# Altium schematic sheet PowerAmplifier_Front.SchDoc
size A4
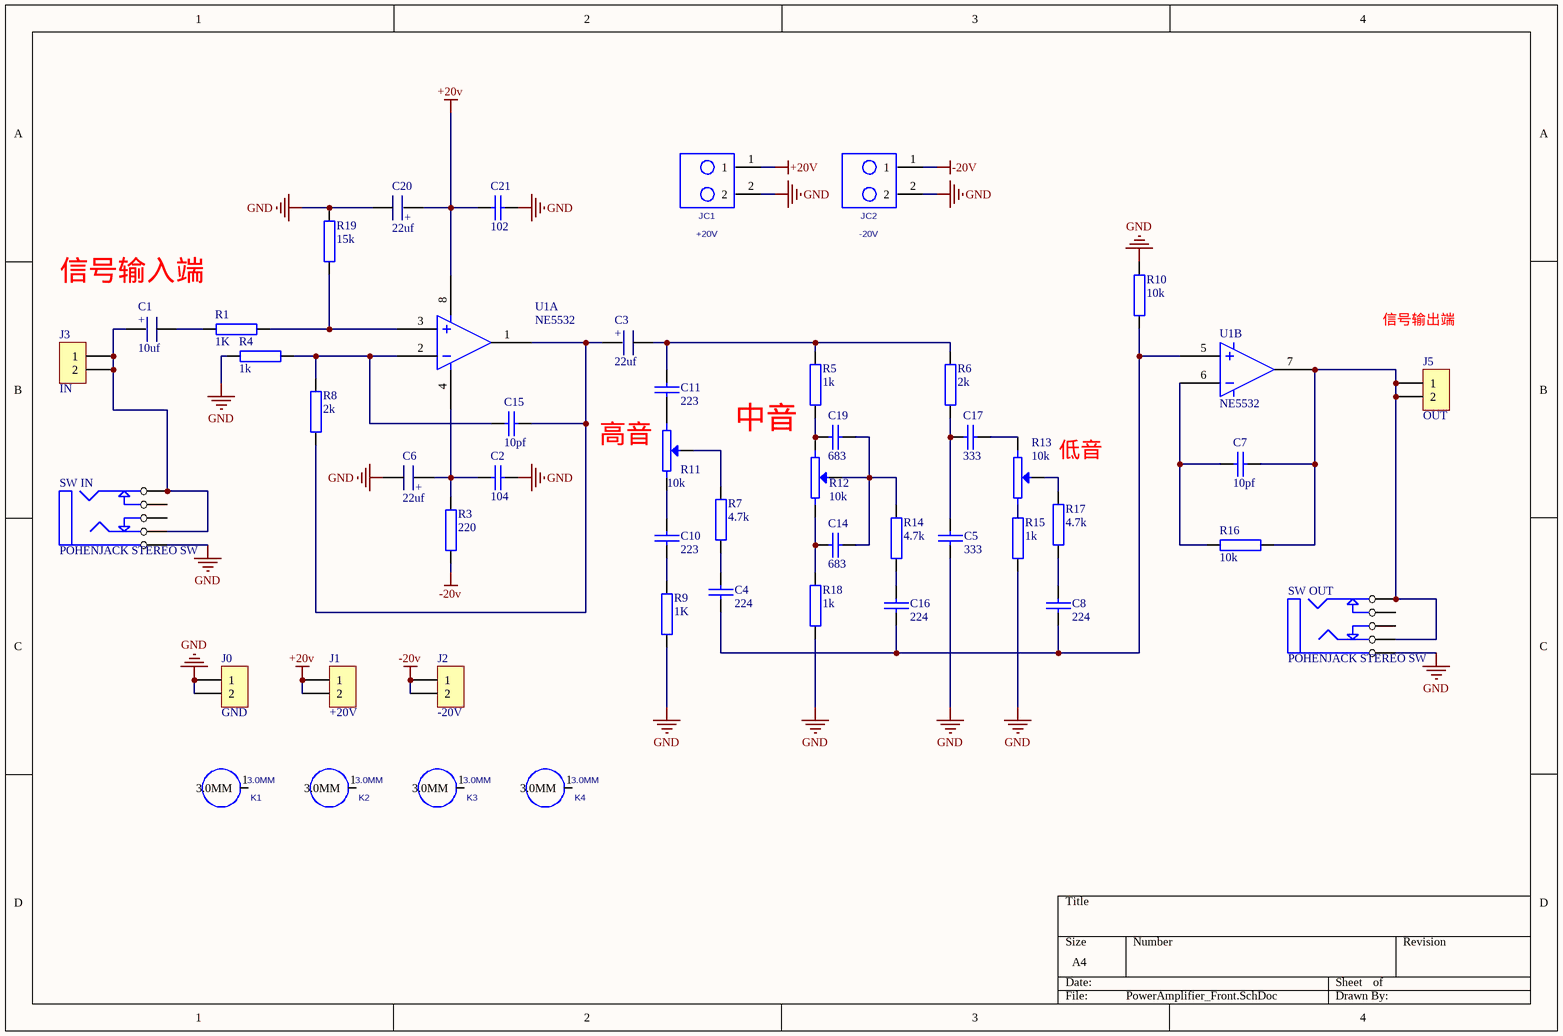
[diagram p0: PowerAmplifier_Front.SchDoc]

## Parts
C1  10uf  [CAP_1]
C2  104  [RAD0.15]
C3  22uf  [CAP_1]
C4  224  [RAD0.15]
C5  333  [RAD0.15]
C6  22uf  [CAP_1]
C7  10pf  [RAD0.15]
C8  224  [RAD0.15]
C10  223  [RAD0.15]
C11  223  [RAD0.15]
C14  683  [RAD0.15]
C15  10pf  [RAD0.15]
C16  224  [RAD0.15]
C17  333  [RAD0.15]
C19  683  [RAD0.15]
C20  22uf  [CAP_1]
C21  102  [RAD0.15]
J0  GND  [sip-2]
J1  +20V  [sip-2]
J2  -20V  [sip-2]
J3  IN  [sip-2]
J5  OUT  [sip-2]
JC1  +20V  [CON_2PIN]
JC2  -20V  [CON_2PIN]
K1  3.0MM  [3.0MM]
K2  3.0MM  [3.0MM]
K3  3.0MM  [3.0MM]
K4  3.0MM  [3.0MM]
R1  1K  [AXIL0.5]
R3  220  [AXIL0.5]
R4  1k  [AXIL0.5]
R5  1k  [AXIL0.5]
R6  2k  [AXIL0.5]
R7  4.7k  [AXIL0.5]
R8  2k  [AXIL0.5]
R9  1K  [AXIL0.5]
R10  10k  [AXIL0.5]
R11  10k  [WH148-1-G15]
R12  10k  [WH148-1-G15]
R13  10k  [WH148-1-G15]
R14  4.7k  [AXIL0.5]
R15  1k  [AXIL0.5]
R16  10k  [AXIL0.5]
R17  4.7k  [AXIL0.5]
R18  1k  [AXIL0.5]
R19  15k  [AXIL0.5]
SW_IN  POHENJACK STEREO SW  [POHENJACK STEREO SW]
SW_OUT  POHENJACK STEREO SW  [POHENJACK STEREO SW]
U1  NE5532  [NE5532]  (parts A,B of 2)

## Nets
+20v: C20.1 C21.1 J1.1 J1.2 JC1.1 U1.8
-20v: J2.1 J2.2 JC2.1 R3.1
GND: C2.2 C5.2 C6.2 C20.2 C21.2 J0.1 J0.2 JC1.2 JC2.2 R4.2 R9.2 R10.2 R15.1 R18.1 R19.2 SW_IN.5(E) SW_OUT.5(E)
NetC1_1: C1.1 J3.1 J3.2 SW_IN.1(A) SW_IN.4(D)
NetC1_2: C1.2 R1.1
NetC2_1: C2.1 C6.1 R3.2 U1.4
NetC3_1: C3.1 C15.2 R8.2 U1.1
NetC3_2: C3.2 C11.2 R5.1 R6.1
NetC4_1: C4.1 R7.2
NetC4_2: C4.2 C8.2 C16.2 R10.1 U1.5
NetC5_1: C5.1 C17.1 R6.2
NetC7_1: C7.1 R16.1 U1.6
NetC7_2: C7.2 J5.1 J5.2 R16.2 SW_OUT.1(A) SW_OUT.4(D) U1.7
NetC8_1: C8.1 R17.1
NetC10_1: C10.1 R11.3
NetC10_2: C10.2 R9.1
NetC11_1: C11.1 R11.1
NetC14_1: C14.1 C19.2 R12.2(W) R14.2
NetC14_2: C14.2 R12.3 R18.2
NetC15_1: C15.1 R4.1 R8.1 U1.2
NetC16_1: C16.1 R14.1
NetC17_2: C17.2 R13.1
NetC19_1: C19.1 R5.2 R12.1
NetR1_2: R1.2 R19.1 U1.3
NetR7_1: R7.1 R11.2(W)
NetR13_2: R13.2(W) R17.2
NetR13_3: R13.3 R15.2

Not connected (* = marked no-connect by the designer): K1 1(3.0MM); K2 1(3.0MM); K3 1(3.0MM); K4 1(3.0MM); SW_IN 2(B) 3(C); SW_OUT 2(B) 3(C)

## Notes on the sheet
- 信号输入端
- 信号输出端
- 高音
- 中音
- 低音
- (in symbol CAP+) +

## Library data of the parts
C1 C3 C6 C20 = CAP+
C2 C11 C15 C16 C21 = Cap1
C4 C5 C7 C8 C10 C14 C17 C19 = CAP1
J0-J3 J5 = CON2: Connector
JC1 JC2 = CON_2PIN: PCB DECAL: CON_2PIN
R1 R3-R10 R14-R19 = 电阻
R11-R13 = 滑动变阻器
K1-K4 = 3.0MM: PCB DECAL: 3.0MM